# EAGLE design Tasmota_ESP32C6-2 (EAGLE 9.6.2)

## Sheet 1 of 7
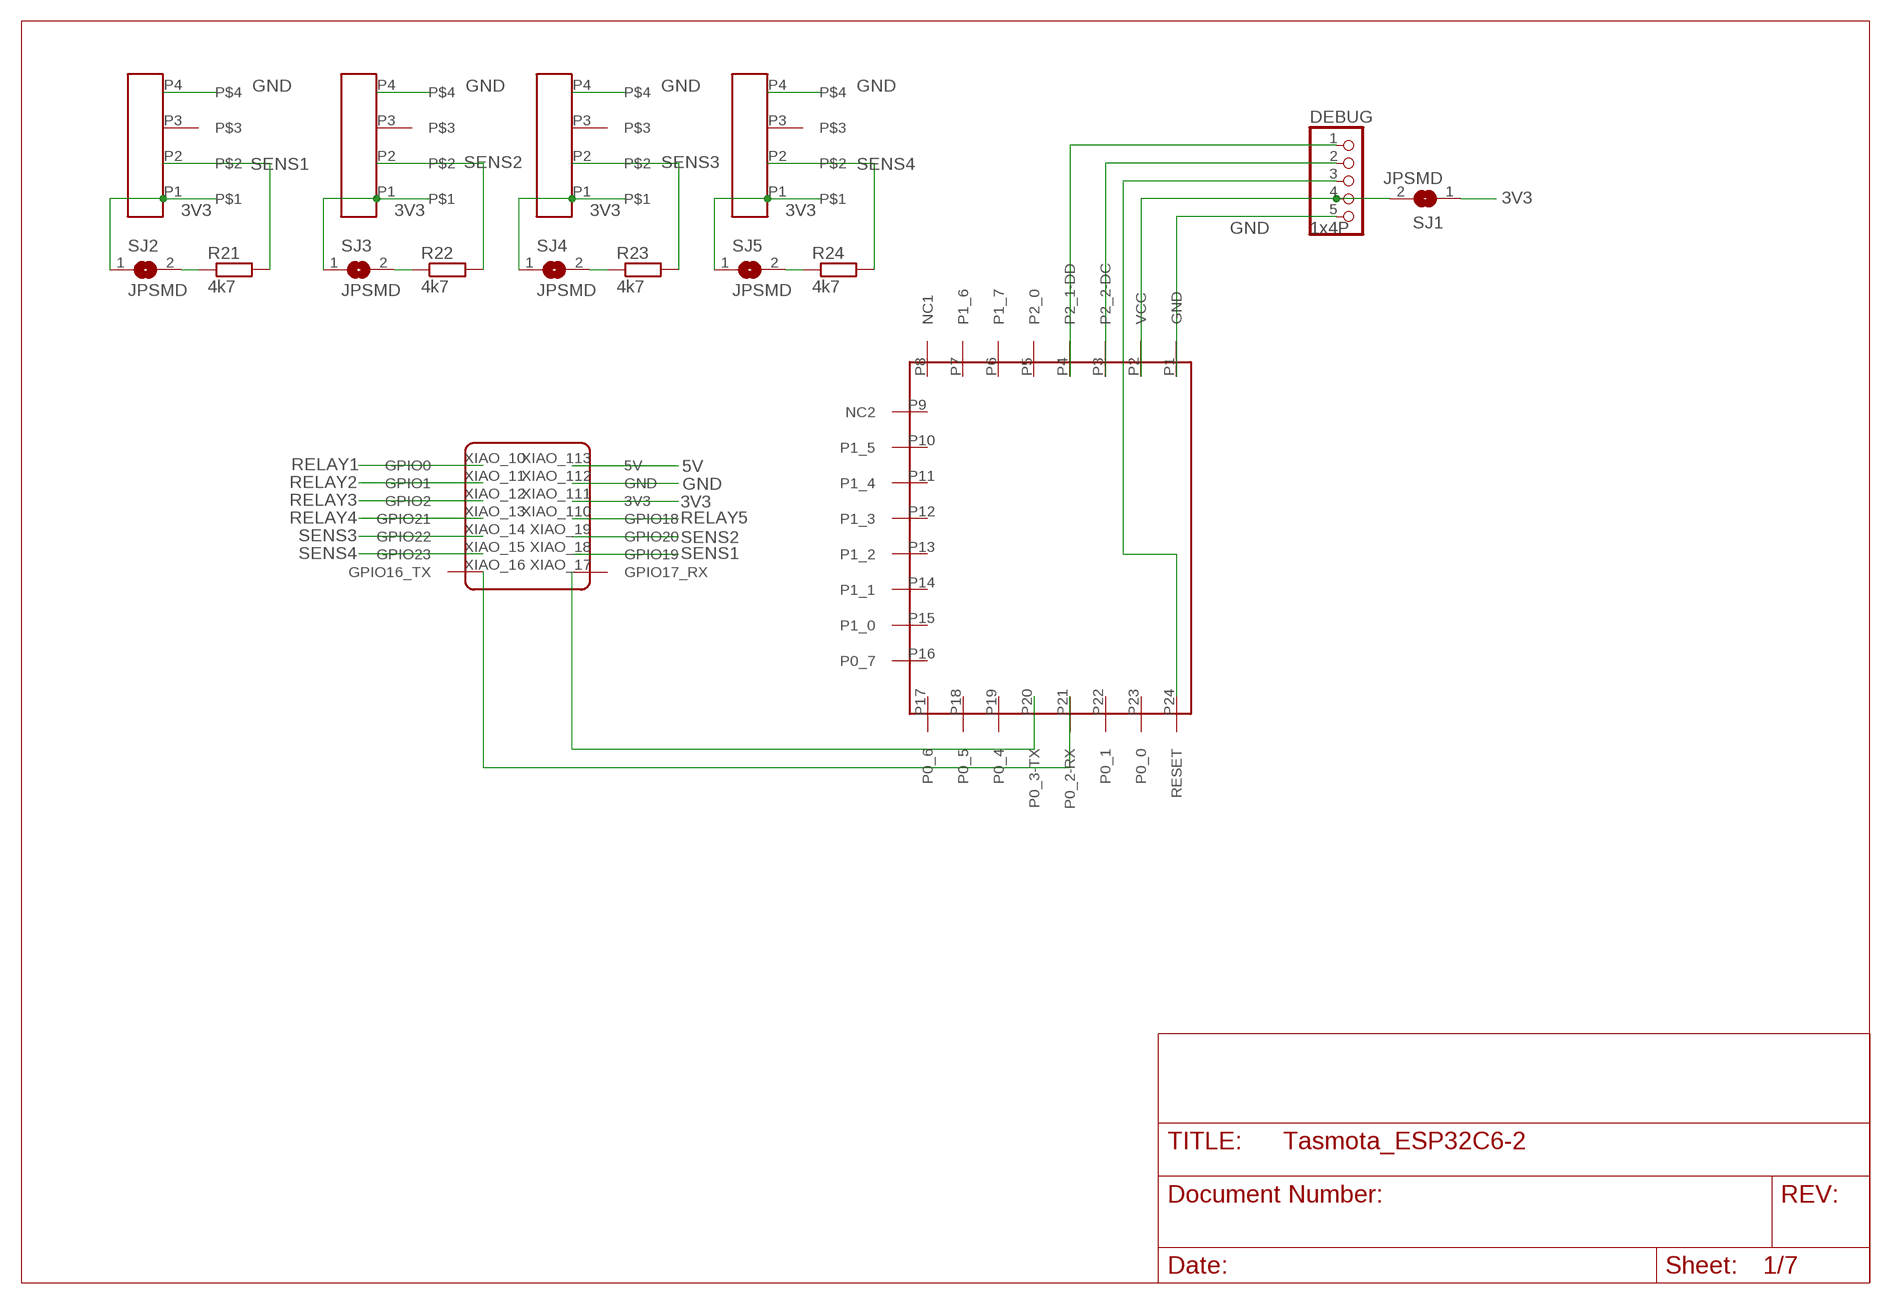
[diagram p0: schematic, sheet 1]

### Parts
DEBUG  1x4P  PINHD-1X5  [1X05]
R21  4k7  R-EU_R0805  [R0805]
R22  4k7  R-EU_R0805  [R0805]
R23  4k7  R-EU_R0805  [R0805]
R24  4k7  R-EU_R0805  [R0805]
SENSOR1  GMX-N-44  GMX-N-4  [GMX-N-4]
SENSOR2  GMX-N-44  GMX-N-4  [GMX-N-4]
SENSOR3  GMX-N-44  GMX-N-4  [GMX-N-4]
SENSOR4  GMX-N-44  GMX-N-4  [GMX-N-4]
SJ1  JPSMD  SJ  [SJ]
SJ2  JPSMD  SJ  [SJ]
SJ3  JPSMD  SJ  [SJ]
SJ4  JPSMD  SJ  [SJ]
SJ5  JPSMD  SJ  [SJ]
U$1  1x7P  XIAO_ESP32C6  [XIAO_ESP32C6]
U$2  EBYTE-E18-MS1  [EBYTE-E18-MS1]

### Nets
3V3 [pwr]: SENSOR1.P1 SENSOR2.P1 SENSOR3.P1 SENSOR4.P1 SJ1.1 SJ2.1 SJ3.1 SJ4.1 SJ5.1 U$1.XIAO_111(3V3)
5V [pwr]: U$1.XIAO_113(5V) ; also sheet 2,3,4,5,6,7
DC: DEBUG.2 U$2.P3(P2_2-DC)
DD: DEBUG.1 U$2.P4(P2_1-DD)
GND [pwr]: DEBUG.5 SENSOR1.P4 SENSOR2.P4 SENSOR3.P4 SENSOR4.P4 U$1.XIAO_112(GND) U$2.P1(GND) ; also sheet 2,3,4,5,6,7
N$4: R21.1 SJ2.2
N$5: R22.1 SJ3.2
N$7: DEBUG.3 U$2.P24(RESET)
N$8: U$1.XIAO_17(GPIO17_RX) U$2.P20(P0_3-TX)
N$9: U$1.XIAO_16(GPIO16_TX) U$2.P21(P0_2-RX)
N$10: R23.1 SJ4.2
N$15: R24.1 SJ5.2
RELAY1: U$1.XIAO_10(GPIO0) ; also sheet 3
RELAY2: U$1.XIAO_11(GPIO1) ; also sheet 4
RELAY3: U$1.XIAO_12(GPIO2) ; also sheet 5
RELAY4: U$1.XIAO_13(GPIO21) ; also sheet 6
RELAY5: U$1.XIAO_110(GPIO18) ; also sheet 7
SENS1: R21.2 SENSOR1.P2 U$1.XIAO_18(GPIO19)
SENS2: R22.2 SENSOR2.P2 U$1.XIAO_19(GPIO20)
SENS3: R23.2 SENSOR3.P2 U$1.XIAO_14(GPIO22)
SENS4: R24.2 SENSOR4.P2 U$1.XIAO_15(GPIO23)
VCC [pwr]: DEBUG.4 SJ1.2 U$2.P2(VCC)
Unconnected: SENSOR1.P3 SENSOR2.P3 SENSOR3.P3 SENSOR4.P3 U$2.P5(P2_0) U$2.P6(P1_7) U$2.P7(P1_6) U$2.P8(NC1) U$2.P9(NC2) U$2.P10(P1_5) U$2.P11(P1_4) U$2.P12(P1_3) U$2.P13(P1_2) U$2.P14(P1_1) U$2.P15(P1_0) U$2.P16(P0_7) U$2.P17(P0_6) U$2.P18(P0_5) U$2.P19(P0_4) U$2.P22(P0_1) U$2.P23(P0_0)

## Sheet 2 of 7
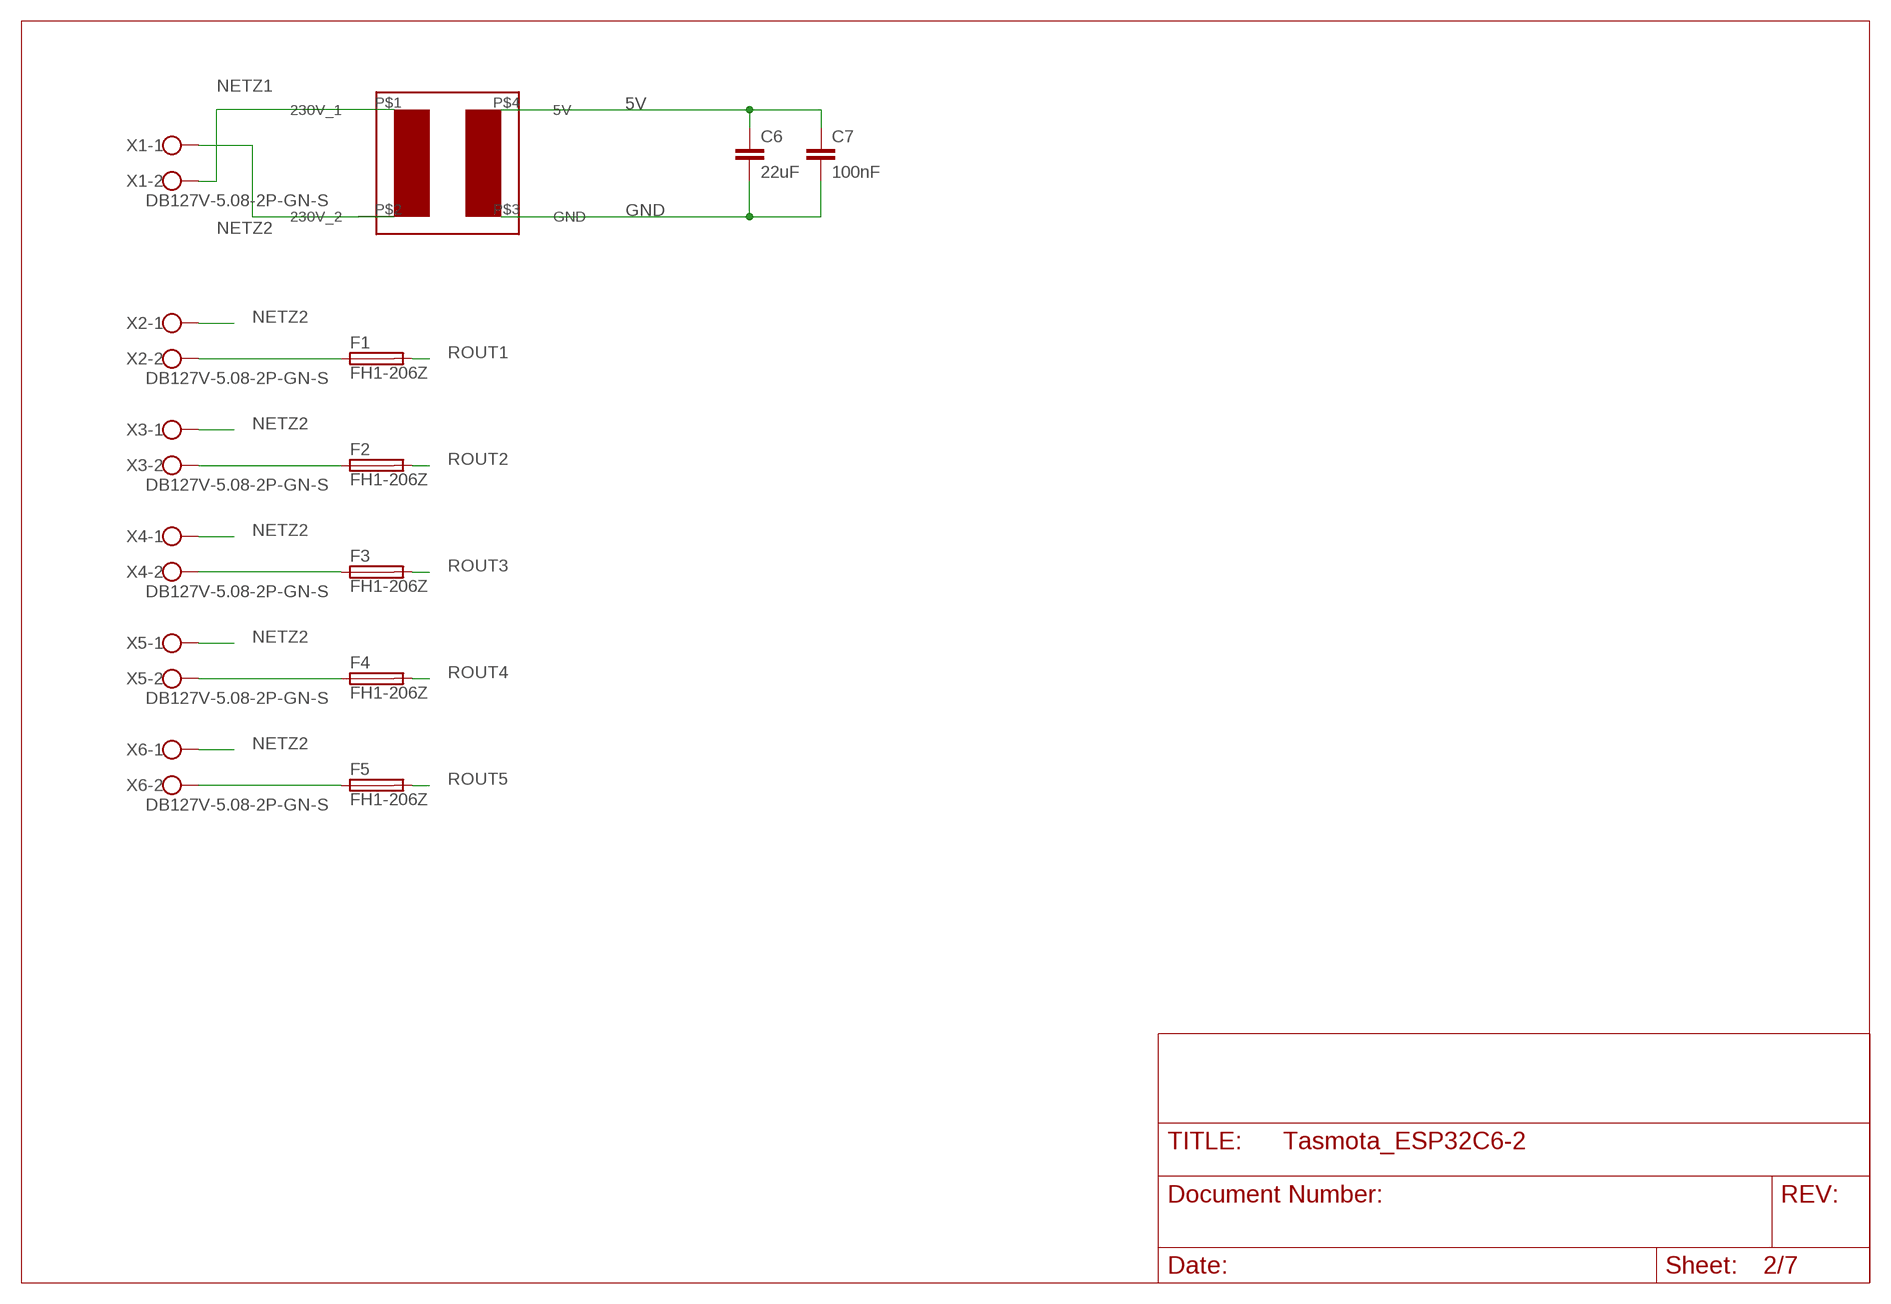
[diagram p1: schematic, sheet 2]

### Parts
C6  22uF  C-EUC0805  [C0805]
C7  100nF  C-EUC0805  [C0805]
F1  FH1-206Z  FUSEHOLDER_10  [FUSEHOLDER_10]
F2  FH1-206Z  FUSEHOLDER_10  [FUSEHOLDER_10]
F3  FH1-206Z  FUSEHOLDER_10  [FUSEHOLDER_10]
F4  FH1-206Z  FUSEHOLDER_10  [FUSEHOLDER_10]
F5  FH1-206Z  FUSEHOLDER_10  [FUSEHOLDER_10]
U$3  HAW3-220S05T2  [HAW3-220S05T2]
X1  DB127V-5.08-2P-GN-S  W237-102  [W237-102]
X2  DB127V-5.08-2P-GN-S  W237-102  [W237-102]
X3  DB127V-5.08-2P-GN-S  W237-102  [W237-102]
X4  DB127V-5.08-2P-GN-S  W237-102  [W237-102]
X5  DB127V-5.08-2P-GN-S  W237-102  [W237-102]
X6  DB127V-5.08-2P-GN-S  W237-102  [W237-102]

### Nets
5V [pwr]: C6.1 C7.1 U$3.P$4(5V) ; also sheet 1,3,4,5,6,7
GND [pwr]: C6.2 C7.2 U$3.P$3(GND) ; also sheet 1,3,4,5,6,7
N$20: F1.1 X2.2
N$25: F2.1 X3.2
N$30: F3.1 X4.2
N$31: F4.1 X5.2
N$32: F5.1 X6.2
NETZ1 [main]: U$3.P$1(230V_1) X1.2 ; also sheet 3,4,5,6,7
NETZ2 [main]: U$3.P$2(230V_2) X1.1 X2.1 X3.1 X4.1 X5.1 X6.1
ROUT1 [main]: F1.2 ; also sheet 3
ROUT2 [main]: F2.2 ; also sheet 4
ROUT3 [main]: F3.2 ; also sheet 5
ROUT4 [main]: F4.2 ; also sheet 6
ROUT5 [main]: F5.2 ; also sheet 7

## Sheet 3 of 7
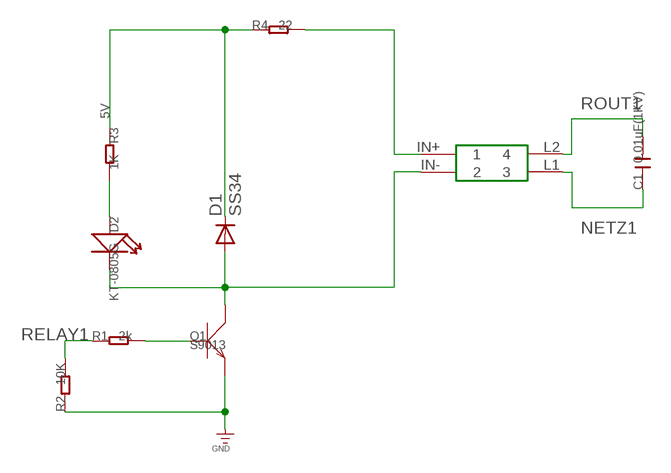
[diagram p2: schematic, sheet 3]

### Parts
C1  0.01uF(1KV)  C-1206  [C1206]
D1  SS34  DIODE-DO-214AC  [DO-214AC]
D2  KT-0805G  LED'0805'  [LED-0805]
Q1  S9013  TRANSISTOR-NPN-SOT23  [SOT23]
R1  2k  R-0805  [R0805]
R2  10K  R-0805  [R0805]
R3  1K  R-0805  [R0805]
R4  22  R-0805  [R0805]
U$4  G3MB-202P  G3MB-202(RELAY)  [G3MB-202(RELAY)]

### Nets
5V [pwr]: D1.C R3.1 R4.1 ; also sheet 1,2,4,5,6,7
GND [pwr]: Q1.2(E) R2.1 ; also sheet 1,2,4,5,6,7
N$1: Q1.1(B) R1.2
N$2: D1.A D2.- Q1.3(C) U$4.IN-
N$3: D2.+ R3.2
N$6: R4.2 U$4.IN+
NETZ1 [main]: C1.1 U$4.L1 ; also sheet 2,4,5,6,7
RELAY1: R1.1 R2.2 ; also sheet 1
ROUT1 [main]: C1.2 U$4.L2 ; also sheet 2

## Sheet 4 of 7
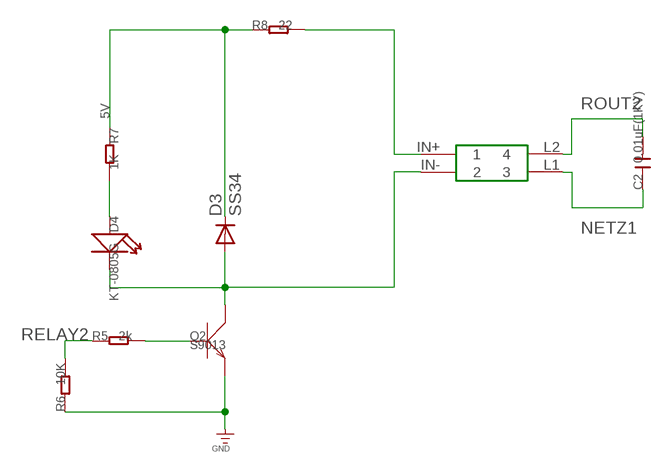
[diagram p3: schematic, sheet 4]

### Parts
C2  0.01uF(1KV)  C-1206  [C1206]
D3  SS34  DIODE-DO-214AC  [DO-214AC]
D4  KT-0805G  LED'0805'  [LED-0805]
Q2  S9013  TRANSISTOR-NPN-SOT23  [SOT23]
R5  2k  R-0805  [R0805]
R6  10K  R-0805  [R0805]
R7  1K  R-0805  [R0805]
R8  22  R-0805  [R0805]
U$6  G3MB-202P  G3MB-202(RELAY)  [G3MB-202(RELAY)]

### Nets
5V [pwr]: D3.C R7.1 R8.1 ; also sheet 1,2,3,5,6,7
GND [pwr]: Q2.2(E) R6.1 ; also sheet 1,2,3,5,6,7
N$11: Q2.1(B) R5.2
N$12: D3.A D4.- Q2.3(C) U$6.IN-
N$13: D4.+ R7.2
N$14: R8.2 U$6.IN+
NETZ1 [main]: C2.1 U$6.L1 ; also sheet 2,3,5,6,7
RELAY2: R5.1 R6.2 ; also sheet 1
ROUT2 [main]: C2.2 U$6.L2 ; also sheet 2

## Sheet 5 of 7
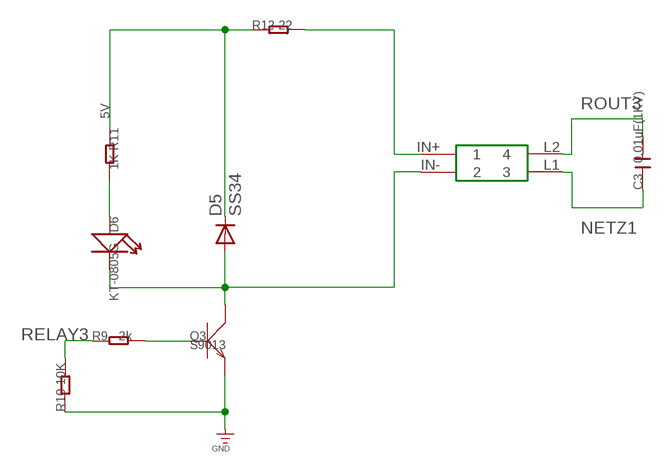
[diagram p4: schematic, sheet 5]

### Parts
C3  0.01uF(1KV)  C-1206  [C1206]
D5  SS34  DIODE-DO-214AC  [DO-214AC]
D6  KT-0805G  LED'0805'  [LED-0805]
Q3  S9013  TRANSISTOR-NPN-SOT23  [SOT23]
R9  2k  R-0805  [R0805]
R10  10K  R-0805  [R0805]
R11  1K  R-0805  [R0805]
R12  22  R-0805  [R0805]
U$8  G3MB-202P  G3MB-202(RELAY)  [G3MB-202(RELAY)]

### Nets
5V [pwr]: D5.C R11.1 R12.1 ; also sheet 1,2,3,4,6,7
GND [pwr]: Q3.2(E) R10.1 ; also sheet 1,2,3,4,6,7
N$16: Q3.1(B) R9.2
N$17: D5.A D6.- Q3.3(C) U$8.IN-
N$18: D6.+ R11.2
N$19: R12.2 U$8.IN+
NETZ1 [main]: C3.1 U$8.L1 ; also sheet 2,3,4,6,7
RELAY3: R9.1 R10.2 ; also sheet 1
ROUT3 [main]: C3.2 U$8.L2 ; also sheet 2

## Sheet 6 of 7
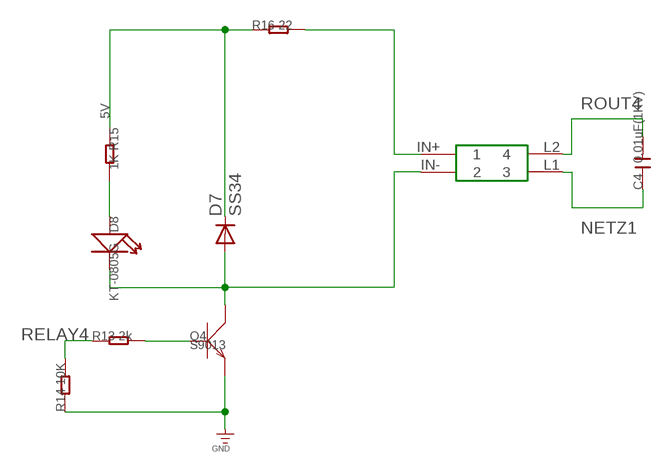
[diagram p5: schematic, sheet 6]

### Parts
C4  0.01uF(1KV)  C-1206  [C1206]
D7  SS34  DIODE-DO-214AC  [DO-214AC]
D8  KT-0805G  LED'0805'  [LED-0805]
Q4  S9013  TRANSISTOR-NPN-SOT23  [SOT23]
R13  2k  R-0805  [R0805]
R14  10K  R-0805  [R0805]
R15  1K  R-0805  [R0805]
R16  22  R-0805  [R0805]
U$10  G3MB-202P  G3MB-202(RELAY)  [G3MB-202(RELAY)]

### Nets
5V [pwr]: D7.C R15.1 R16.1 ; also sheet 1,2,3,4,5,7
GND [pwr]: Q4.2(E) R14.1 ; also sheet 1,2,3,4,5,7
N$21: Q4.1(B) R13.2
N$22: D7.A D8.- Q4.3(C) U$10.IN-
N$23: D8.+ R15.2
N$24: R16.2 U$10.IN+
NETZ1 [main]: C4.1 U$10.L1 ; also sheet 2,3,4,5,7
RELAY4: R13.1 R14.2 ; also sheet 1
ROUT4 [main]: C4.2 U$10.L2 ; also sheet 2

## Sheet 7 of 7
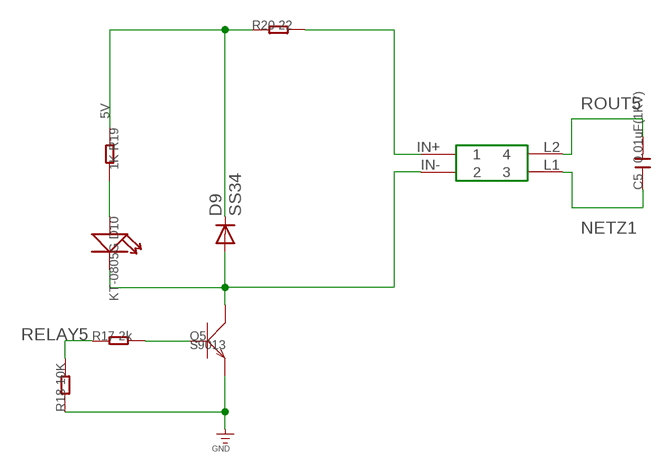
[diagram p6: schematic, sheet 7]

### Parts
C5  0.01uF(1KV)  C-1206  [C1206]
D9  SS34  DIODE-DO-214AC  [DO-214AC]
D10  KT-0805G  LED'0805'  [LED-0805]
Q5  S9013  TRANSISTOR-NPN-SOT23  [SOT23]
R17  2k  R-0805  [R0805]
R18  10K  R-0805  [R0805]
R19  1K  R-0805  [R0805]
R20  22  R-0805  [R0805]
U$12  G3MB-202P  G3MB-202(RELAY)  [G3MB-202(RELAY)]

### Nets
5V [pwr]: D9.C R19.1 R20.1 ; also sheet 1,2,3,4,5,6
GND [pwr]: Q5.2(E) R18.1 ; also sheet 1,2,3,4,5,6
N$26: Q5.1(B) R17.2
N$27: D9.A D10.- Q5.3(C) U$12.IN-
N$28: D10.+ R19.2
N$29: R20.2 U$12.IN+
NETZ1 [main]: C5.1 U$12.L1 ; also sheet 2,3,4,5,6
RELAY5: R17.1 R18.2 ; also sheet 1
ROUT5 [main]: C5.2 U$12.L2 ; also sheet 2

## Library data of the parts
C1-C5 = Discrete:C*: Ceramic Capacitors
C6 C7 = rcl:C-EU: CAPACITOR, European symbol; SPICEPREFIX: C
D1 D3 D5 D7 D9 = diode:DIODE-: DIODE
D2 D4 D6 D8 D10 = Discrete:LED*
DEBUG = pinhead:PINHD-1X5: PIN HEADER
F1-F5 = MK312parts:FUSEHOLDER_10: FUSE Wickmann; OC_FARNELL: unknown; OC_NEWARK: unknown
Q1-Q5 = Discrete:TRANSISTOR-NPN*: NPN audion
R1-R20 = Discrete:R*
R21-R24 = rcl:R-EU_: RESISTOR, European symbol; SPICEPREFIX: R
SENSOR1-SENSOR4 = MK312parts:GMX-N-4
SJ1-SJ5 = jumper:SJ: SMD solder JUMPER
U$1 = MK312parts:XIAO_ESP32C6
U$2 = MK312parts:EBYTE-E18-MS1
U$3 = MK312parts:HAW3-220S05T2
U$4 U$6 U$8 U$10 U$12 = G3MB-202(relay):G3MB-202(RELAY)
X1 = con-wago-500:W237-102: WAGO SCREW CLAMP; MPN: 237-102; OC_FARNELL: unknown; OC_NEWARK: 70K9898
X2-X6 = MK312parts:W237-102: WAGO SCREW CLAMP; MPN: 237-102; OC_FARNELL: unknown; OC_NEWARK: 70K9898

## Net classes
0 default: width 0.25 mm, drill 0.4 mm, clearance 0.2 mm
1 pwr: width 0.3 mm, drill 0.5 mm, clearance 0.2 mm
2 main: width 1 mm, drill 0.6 mm, clearance 2 mm

## Board
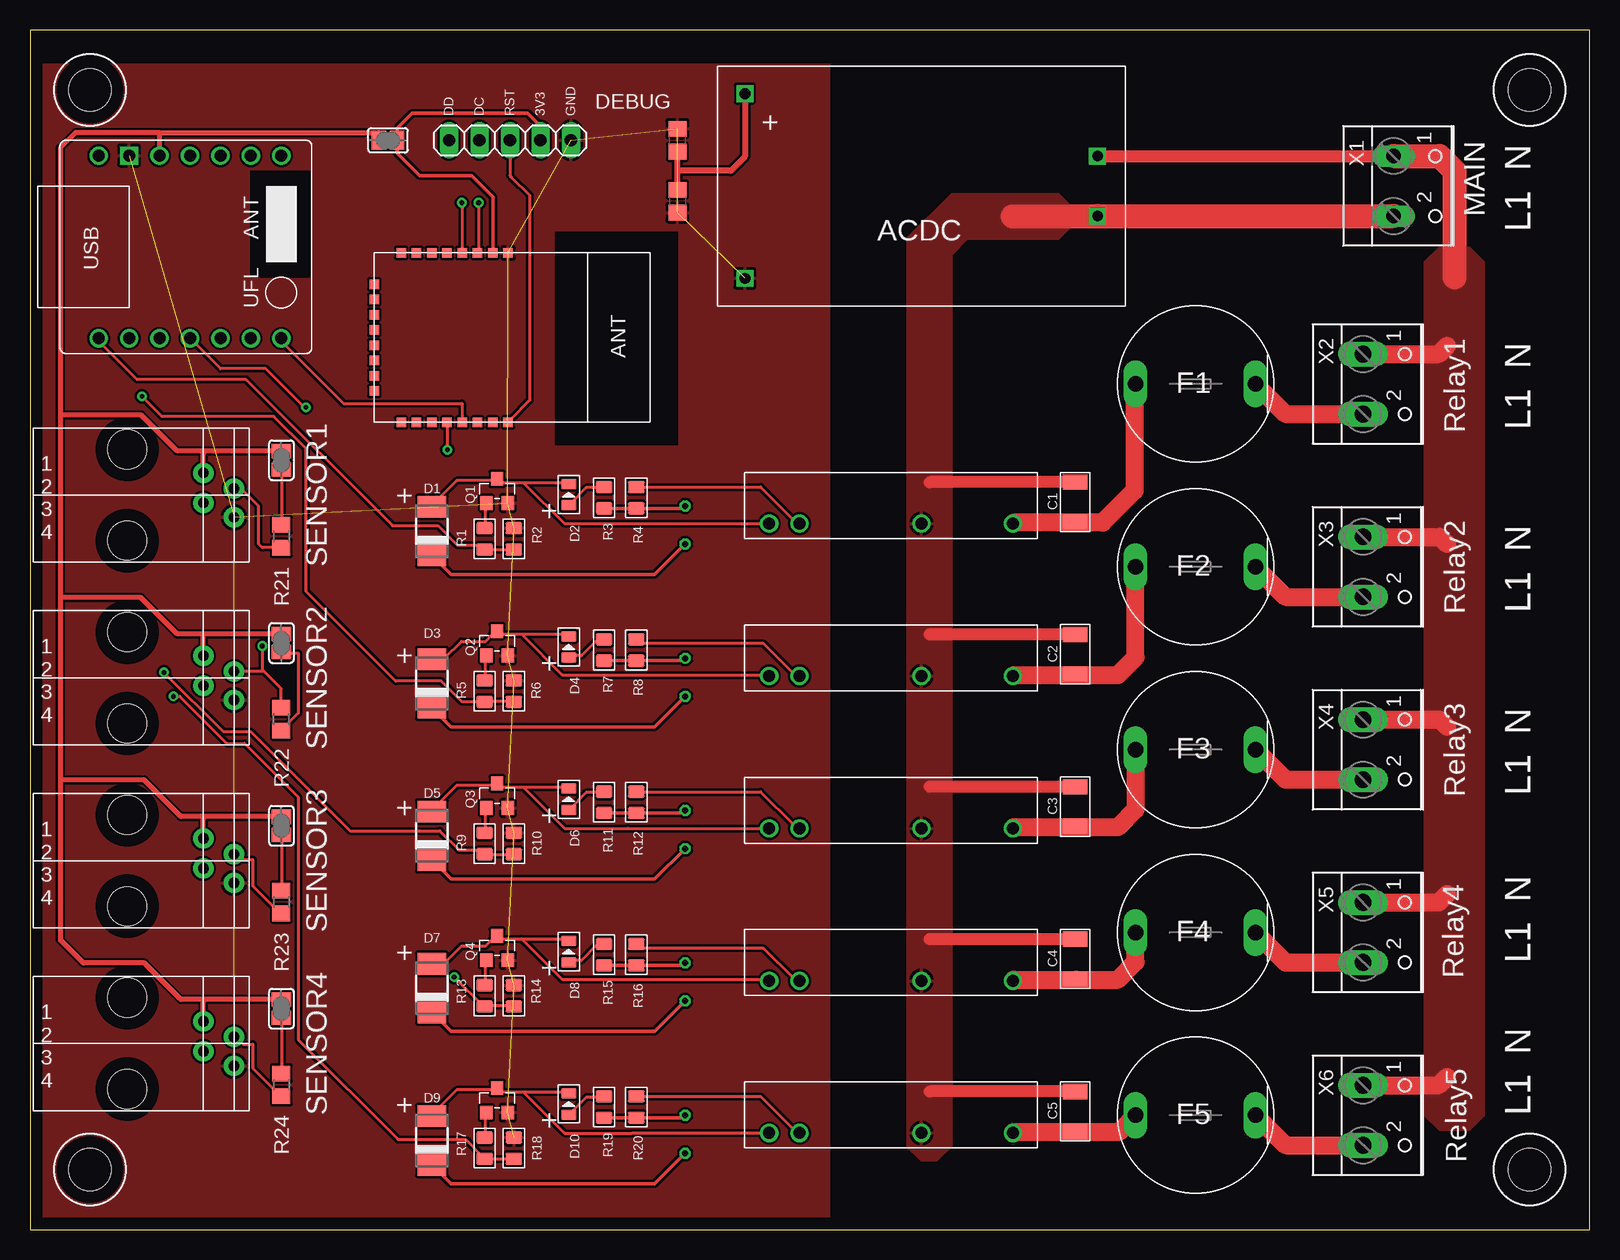
[diagram p7: board, top side]
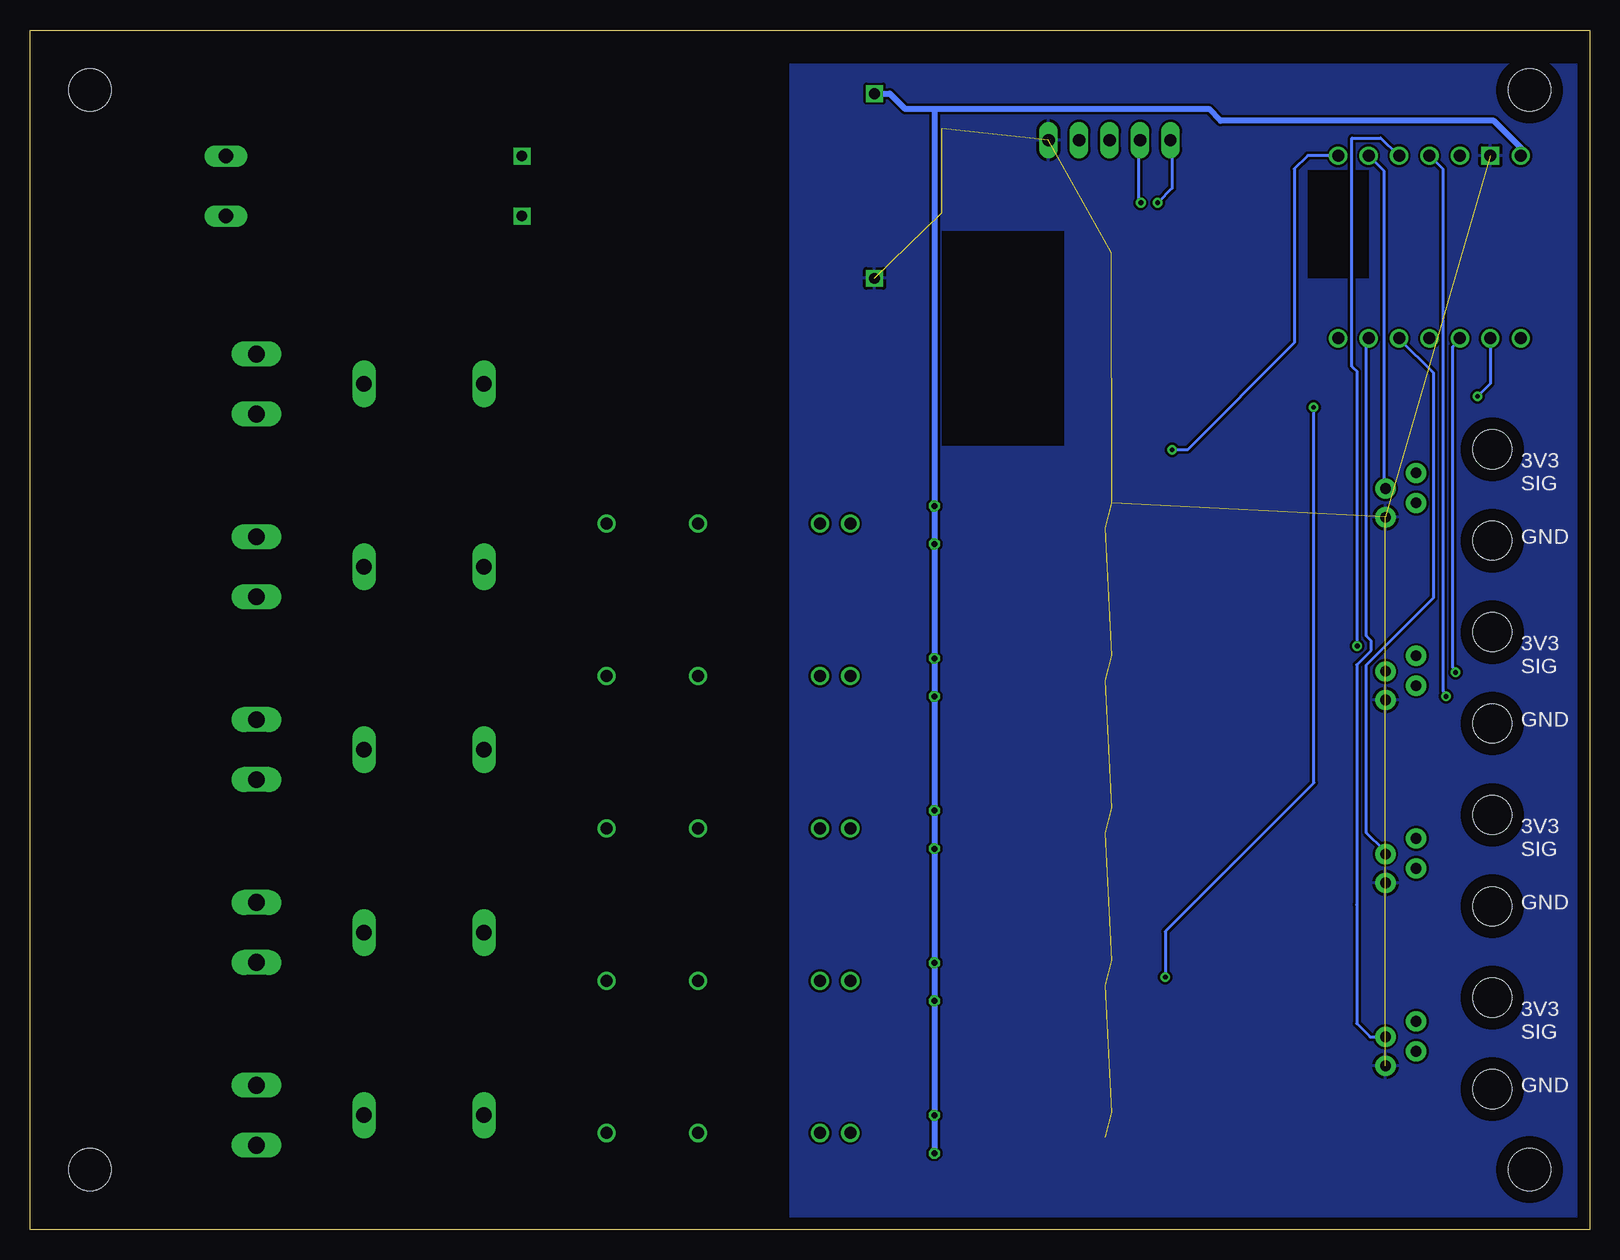
[diagram p8: board, bottom side, seen from below]

Size 130 x 100 mm. Coordinates in mm from the lower left corner, seen from the top.
Outline: 0,0 130,0 130,100 0,100 0,0
Copper layers (1*16): Top 0.035mm / dielectric 1.5mm / Bottom 0.035mm
Design rules "default": minimum track width 6mil, minimum drill 0.35mm, track to track 6mil, track to pad 6mil, pad to pad 6mil, via to via 6mil, smd to smd 6mil, copper to edge 40mil, drill to drill 6mil, minimum pad ring 10mil, minimum via ring 8mil, stop-mask expansion 4mil, vias tented up to drill 0mil, thermal gap 10mil
Holes 3.5 mm at 125,95 125,5 5,95 5,5
tRestrict: area 67.9,3.2 to 73,98.4
bRestrict: area 67.9,3.2 to 73,98.4

### Footprints (pad centres in the part's own frame; a part is rotated, then mirrored left to right if it is on the bottom)
C1206 = smd 1.27 x 2.032: 1 -1.651,0; 2 1.651,0
C0805 = smd 1.3 x 1.5: 1 -0.95,0; 2 0.95,0
DO-214AC = smd 1.8 x 2.4: A 2.025,0; C -2.025,0
LED-0805 = smd 0.889 x 1.27: + -0.889,0; - 0.889,0
1X05 = drill 1.016 long: 1 -5.08,0; 2 -2.54,0; 3 0,0; 4 2.54,0; 5 5.08,0
FUSEHOLDER_10 = drill 1.3 long: 1 -5,0; 2 5,0
SOT23 = smd 1.016 x 1.143: 1 -0.889,-1.016; 2 0.889,-1.016; 3 0,1.016
R0805 = smd 1.016 x 1.397: 1 -0.889,0; 2 0.889,0
R0805' = smd 1.3 x 1.5: 1 -0.95,0; 2 0.95,0
GMX-N-4 = drill 0.9 pad 1.676: P1 14.2,7.45; P2 16.75,6.15; P3 14.2,4.95; P4 16.75,3.75 | hole 3.25: 7.85,1.8; 7.85,9.42
SJ = smd 1.168 x 1.6: 1 -0.762,0; 2 0.762,0
XIAO_ESP32C6 = drill 1: XIAO_10 1.27,17.78; XIAO_11 1.27,15.24; XIAO_12 1.27,12.7; XIAO_13 1.27,10.16; XIAO_14 1.27,7.62; XIAO_15 1.27,5.08; XIAO_16 1.27,2.54; XIAO_17 16.51,2.54; XIAO_18 16.51,5.08; XIAO_19 16.51,7.62; XIAO_110 16.51,10.16; XIAO_111 16.51,12.7; XIAO_113 16.51,17.78 | drill 1 square: XIAO_112 16.51,15.24
EBYTE-E18-MS1 = smd 0.8 x 0.8: P1 11.14,14.11; P2 9.87,14.11; P3 8.6,14.11; P4 7.33,14.11; P5 6.06,14.11; P6 4.79,14.11; P7 3.52,14.11; P8 2.25,14.11; P9 0,11.49; P10 0,10.22; P11 0,8.95; P12 0,7.68; P13 0,6.41; P14 0,5.14; P15 0,3.87; P16 0,2.6; P17 2.25,-0.03; P18 3.52,-0.03; P19 4.79,-0.03; P20 6.06,-0.03; P21 7.33,-0.03; P22 8.6,-0.03; P23 9.87,-0.03; P24 11.14,-0.03
HAW3-220S05T2 = drill 0.9 square: P$1 -14.7,2.5; P$2 -14.7,-2.5; P$3 14.7,7.7; P$4 14.7,-7.7
G3MB-202(RELAY) = drill 1: IN+ -7.62,2.54; IN- -10.16,2.54; L1 2.54,2.54; L2 10.16,2.54
W237-102 = drill 1.194 long: 1 -2.5,-1.27; 2 2.5,-1.27
W237-102' = drill 1.4 long: 1 -2.5,-1.27; 2 2.5,-1.27

### Placement (x,y rotation side)
C1  87.12,60.66 270 top
C2  87.12,47.96 270 top
C3  87.12,35.26 270 top
C4  87.12,22.56 270 top
C5  87.12,9.86 270 top
C6  53.98,90.81 90 top
C7  53.98,85.72 270 top
D1  33.5,58.22 90 top
D2  44.91,61.26 90 top
D3  33.5,45.52 90 top
D4  44.91,48.56 90 top
D5  33.5,32.82 90 top
D6  44.91,35.86 90 top
D7  33.5,20.12 90 top
D8  44.91,23.16 90 top
D9  33.5,7.42 90 top
D10  44.91,10.46 90 top
DEBUG  40.01,90.81 0 top
F1  97.16,70.48 180 top
F2  97.16,55.24 180 top
F3  97.16,40.01 180 top
F4  97.16,24.77 180 top
F5  97.16,9.53 180 top
Q1  38.94,61.57 0 top
Q2  38.94,48.87 0 top
Q3  38.94,36.17 0 top
Q4  38.94,23.47 0 top
Q5  38.94,10.77 0 top
R1  37.9,57.58 90 top
R2  40.34,57.58 270 top
R3  47.85,61.01 90 top
R4  50.55,61.01 90 top
R5  37.9,44.88 90 top
R6  40.34,44.88 270 top
R7  47.85,48.31 90 top
R8  50.55,48.31 90 top
R9  37.9,32.18 90 top
R10  40.34,32.18 270 top
R11  47.85,35.61 90 top
R12  50.55,35.61 90 top
R13  37.9,19.48 90 top
R14  40.34,19.48 270 top
R15  47.85,22.91 90 top
R16  50.55,22.91 90 top
R17  37.9,6.78 90 top
R18  40.34,6.78 270 top
R19  47.85,10.21 90 top
R20  50.55,10.21 90 top
R21  4k7  [R0805']  20.95,57.78 270 top
R22  4k7  [R0805']  20.95,42.55 90 top
R23  4k7  [R0805']  20.95,27.3 270 top
R24  4k7  [R0805']  20.95,12.06 270 top
SENSOR1  0.25,55.63 0 top
SENSOR2  0.25,40.39 0 top
SENSOR3  0.25,25.15 0 top
SENSOR4  0.25,9.91 0 top
SJ1  29.84,90.81 0 top
SJ2  20.95,64.14 270 top
SJ3  20.95,48.9 270 top
SJ4  20.95,33.66 270 top
SJ5  20.95,18.41 270 top
U$1  23.5,73.03 90 top
U$2  28.7,67.31 0 top
U$3  74.3,87 180 top
U$4  71.78,56.3 0 top
U$6  71.78,43.6 0 top
U$8  71.78,30.9 0 top
U$10  71.78,18.2 0 top
U$12  71.78,5.5 0 top
X1  114.94,87 270 top
X2  DB127V-5.08-2P-GN-S  [W237-102']  112.39,70.48 270 top
X3  DB127V-5.08-2P-GN-S  [W237-102']  112.39,55.24 270 top
X4  DB127V-5.08-2P-GN-S  [W237-102']  112.39,40.01 270 top
X5  DB127V-5.08-2P-GN-S  [W237-102']  112.39,24.77 270 top
X6  DB127V-5.08-2P-GN-S  [W237-102']  112.39,9.53 270 top

### Tracks (layer width: path | path; a pad name or v marks a point on that pad's centre or on a via)
3V3
  Top 0.406: U$1.XIAO_111 10.79,91.44 | 10.79,91.44 29.08,91.44 SJ1.1 | 10.79,91.44 3.81,91.44 2.54,90.17 2.54,67.94 | 2.54,67.94 2.54,52.7 | 2.54,52.7 2.54,37.47 | 2.54,37.47 2.54,24.13 4.45,22.23 9.53,22.23 12.57,19.18 14.61,19.18 | SJ2.1 14.61,64.9 | 14.61,64.9 12.28,64.9 9.28,67.89 2.6,67.89 2.54,67.94 | 2.54,37.47 9.53,37.47 12.57,34.42 14.61,34.42 | SENSOR1.P1 14.45,64.75 14.61,64.9 | SJ3.1 14.61,49.66 | 14.61,49.66 12.28,49.66 9.23,52.7 2.54,52.7 | SENSOR2.P1 14.45,49.51 14.61,49.66 | SJ4.1 14.61,34.42 | SENSOR3.P1 14.45,34.27 14.61,34.42 | SJ5.1 14.61,19.18 | SENSOR4.P1 14.45,19.03 14.61,19.18
5V  (via drill 0.5)
  Top 0.3: R3.1 R4.1 54.41,60.12 v54.61,60.33 | R7.1 R8.1 54.41,47.42 v54.61,47.62 | R11.1 R12.1 54.41,34.72 v54.61,34.92 | R15.1 R16.1 54.41,22.02 v54.61,22.23 | R19.1 R20.1 54.41,9.32 v54.61,9.53 | D7.C 35.08,16.51 52.07,16.51 v54.61,19.05 | D9.C 35.08,3.81 52.07,3.81 v54.61,6.35 | D5.C 35.08,29.21 52.07,29.21 v54.61,31.75 | D3.C 35.08,41.91 52.07,41.91 v54.61,44.45 | D1.C 35.08,54.61 52.07,54.61 v54.61,57.15
  Top 0.508: C7.1 53.98,88.27 | 53.98,88.27 C6.1 | U$3.P$4 59.59,89.44 58.42,88.27 53.98,88.27
  Bottom 0.508: U$3.P$4 58.33,94.69 57.05,93.42 54.61,93.42 | 54.61,93.42 31.75,93.42 30.76,92.43 7.98,92.43 5.71,90.17 U$1.XIAO_113 | 54.61,93.42 v54.61,60.33 v54.61,57.15 v54.61,47.62 v54.61,44.45 v54.61,34.92 v54.61,31.75 v54.61,22.23 v54.61,19.05 v54.61,9.53 v54.61,6.35
DC  (via drill 0.4)
  Top 0.25: v37.4,85.6 37.4,81.47 U$2.P3
  Bottom 0.25: v37.4,85.6 37.6,85.8 37.6,90.67 DEBUG.2
DD  (via drill 0.4)
  Top 0.254: v36,85.6 36,81.45 U$2.P4
  Bottom 0.25: v36,85.6 34.8,86.8 34.8,90.67 DEBUG.1
GND  (19 unrouted)
  pour Top: 66.67,97.16 0.64,97.16 0.64,0.64 66.67,0.64
  pour Bottom: 0.64,97.16 66.67,97.16 66.67,0.64 65.41,0.64 0.64,0.64
  cutout Bottom: 43.81,83.19 53.98,83.19 53.98,65.41 43.81,65.41
  cutout Bottom: 18.41,88.27 23.5,88.27 23.5,79.38 18.41,79.38
  cutout Top: 18.41,88.27 23.5,88.27 23.5,79.38 18.41,79.38
  cutout Top: 43.81,83.19 53.98,83.19 53.98,65.41 43.81,65.41
N$1
  Top 0.25: Q1.1 37.97,60.44 37.97,58.63 R1.2
N$2
  Top 0.25: 41.16,62.23 44.77,62.23 D2.- | 41.16,62.23 39.16,62.23 38.97,62.44 Q1.3 38.77,62.44 35.56,62.44 33.56,60.44 D1.A | 41.16,62.23 44.56,58.84 49.82,58.84 U$4.IN-
N$3
  Top 0.25: D2.+ 44.97,60.44 46.37,61.84 47.77,61.84 R3.2
N$4
  Top 0.25: R21.1 20.96,58.84 20.96,63.24 SJ2.2
N$5
  Top 0.25: R22.1 20.96,41.65 22.36,43.05 22.36,48.05 20.96,48.05 SJ3.2
N$6
  Top 0.25: R4.2 60.9,61.9 63.77,59.03 63.97,59.03 U$4.IN+
N$7
  Top 0.25: 40.12,87.75 41.66,86.21 41.66,69.13 40,67.47 U$2.P24
  Top 0.254: DEBUG.3 40.01,87.86 40.12,87.75
N$8  (via drill 0.4)
  Top 0.25: v34.8,65 34.8,67.27 U$2.P20
  Bottom 0.25: v34.8,65 33.53,65 24.61,73.92 24.61,88.42 23.5,89.53 U$1.XIAO_17
N$9
  Top 0.25: U$2.P21 36,67.47 36,68.87 26.13,68.87 20.8,74.2 U$1.XIAO_16
N$10
  Top 0.25: R23.1 20.96,28.45 20.96,32.84 SJ4.2
N$11
  Top 0.25: Q2.1 37.97,47.84 37.97,45.84 R5.2
N$12
  Top 0.25: 38.56,49.63 37.97,49.03 35.97,49.03 34.56,47.63 33.56,47.63 D3.A | 38.56,49.63 38.77,49.84 Q2.3 38.56,49.63 | 38.56,49.63 40.97,49.63 | 40.97,49.63 44.77,49.63 D4.- | 40.97,49.63 44.37,46.23 61.56,46.23 U$6.IN-
N$13
  Top 0.25: D4.+ 44.97,47.84 45.97,47.84 47.16,49.03 47.77,49.03 R7.2
N$14
  Top 0.25: R8.2 50.56,49.03 50.77,48.84 61.16,48.84 63.77,46.23 63.97,46.23 U$6.IN+
N$15
  Top 0.25: R24.1 20.96,13.04 20.96,17.64 SJ5.2
N$16
  Top 0.25: Q3.1 37.97,35.03 37.97,33.23 R9.2
N$17
  Top 0.25: 41.16,36.84 44.77,36.84 D6.- | 41.16,36.84 39.16,36.84 38.97,37.03 Q3.3 38.77,37.03 35.56,37.03 33.56,35.03 D5.A | 41.16,36.84 44.56,33.44 49.82,33.44 U$8.IN-
N$18
  Top 0.25: D6.+ 44.97,35.03 46.37,36.44 47.77,36.44 R11.2
N$19
  Top 0.25: R12.2 60.9,36.5 63.77,33.63 63.97,33.63 U$8.IN+
N$20
  Top 1.5: F1.1 104.66,67.98 X2.2
N$21
  Top 0.25: Q4.1 37.97,22.43 37.97,20.43 R13.2
N$22
  Top 0.25: 38.56,24.23 37.97,23.64 35.97,23.64 34.56,22.23 33.56,22.23 D7.A | 38.56,24.23 38.77,24.43 Q4.3 38.56,24.23 | 38.56,24.23 40.97,24.23 | 40.97,24.23 44.77,24.23 D8.- | 40.97,24.23 44.37,20.84 61.56,20.84 U$10.IN-
N$23
  Top 0.25: D8.+ 44.97,22.43 45.97,22.43 47.16,23.64 47.77,23.64 R15.2
N$24
  Top 0.25: R16.2 50.56,23.64 50.77,23.43 61.16,23.43 63.77,20.84 63.97,20.84 U$10.IN+
N$25
  Top 1.5: F2.1 104.66,52.74 X3.2
N$26
  Top 0.25: Q5.1 37.97,9.63 37.97,7.83 R17.2
N$27
  Top 0.25: 41.16,11.44 44.77,11.44 D10.- | 41.16,11.44 39.16,11.44 38.97,11.63 Q5.3 38.77,11.63 35.56,11.63 33.56,9.63 D9.A | 41.16,11.44 44.56,8.04 50.19,8.04 U$12.IN-
N$28
  Top 0.25: D10.+ 44.97,9.63 46.37,11.04 47.77,11.04 R19.2
N$29
  Top 0.25: R20.2 60.9,11.1 63.77,8.23 63.97,8.23 U$12.IN+
N$30
  Top 1.5: F3.1 104.66,37.51 X4.2
N$31
  Top 1.5: F4.1 104.66,22.27 X5.2
N$32
  Top 1.5: F5.1 104.66,7.03 X6.2
NETZ1
  Top 1.016: C1.1 75.01,62.31 | C2.1 75.01,49.61 | C3.1 75.01,36.91 | C4.1 75.01,24.21 | C5.1 75.01,11.51
  Top 2: X1.2 U$3.P$1 88.95,84.45 81.92,84.45
  pour Top: 73.03,6.99 74.3,5.71 75.56,5.71 76.83,6.99 76.83,81.28 78.11,82.55 85.72,82.55 87,83.82 87,85.09 85.72,86.36 76.83,86.36 73.03,82.55
NETZ2
  Top 1.016: U$3.P$2 X1.1
  Top 1.5: X2.1 117.44,72.98 118.11,73.66 | X3.1 117.52,57.74 118.11,57.15 | X4.1 117.52,42.51 118.11,41.91 | X5.1 117.44,27.27 118.11,27.94 | X6.1 117.44,12.03 118.11,12.7
  Top 2: X1.1 117.52,89.5 118.75,88.27 118.75,79.38
  pour Top: 116.2,9.53 117.47,8.26 120.02,8.26 121.28,9.53 121.28,80.64 120.02,81.92 117.47,81.92 116.2,80.64
RELAY1
  Top 0.25: R2.2 40.16,56.63 37.97,56.63 R1.1 37.6,57.07 35.6,57.07 34,58.67 30.21,58.67 17.98,70.89 8.9,70.89 5.6,74.2 U$1.XIAO_10
RELAY2  (via drill 0.4)
  Top 0.25: R5.1 37.97,44.03 40.16,44.03 R6.2 | v9.33,69.46 11.01,67.78 20.32,67.78 23,65.11 23,59.69
  Top 0.254: R5.1 36.02,43.99 34.29,45.72 30.48,45.72 23,53.2 23,59.69
  Bottom 0.25: v9.33,69.46 8.26,70.53 U$1.XIAO_11
RELAY3  (via drill 0.4)
  Top 0.25: R10.2 40.16,31.23 37.97,31.23 R9.1 37.77,31.43 37.56,31.64 35.77,31.64 34.16,33.23 26.67,33.23 | v11.16,46.45 16.11,41.51
  Top 0.254: 16.11,41.51 18.4,41.51 26.67,33.23
  Bottom 0.25: U$1.XIAO_12 10.8,74.2 11.4,73.6 11.4,46.88 11.2,46.68 11.2,46.48 v11.16,46.45
RELAY4  (via drill 0.4)
  Top 0.25: R14.2 40.16,18.64 37.97,18.64 R13.1 37.77,18.64 v35.37,21.04 | v23,68.55 22.86,68.55 19.66,71.75 15.88,71.75 U$1.XIAO_13
  Bottom 0.25: v35.37,21.04 35.37,24.84 22.96,37.24 23,37.28 v23,68.55
RELAY5  (via drill 0.4)
  Top 0.25: R18.2 40.16,5.83 37.97,5.83 R17.1 37.77,6.04 36.3,7.5 30.68,7.5 22.36,15.82 22.36,34.29 | 16.41,40.53 12.49,44.45 v11.96,44.45
  Top 0.254: 16.41,40.53 17.89,40.53 22.36,36.05 22.36,34.29
  Bottom 0.25: U$1.XIAO_110 12.2,88.4 12.2,44.88 12,44.68 12,44.48 v11.96,44.45
ROUT1
  Top 1: C1.2 87.2,59.07 87.2,58.92
  Top 1.5: U$4.L2 82.02,58.92 87.2,58.92 89.4,58.92 92.08,61.59 92.08,70.41 F1.2
ROUT2
  Top 1: C2.2 87.2,46.27 87.2,46.22
  Top 1.5: U$6.L2 82.02,46.22 87.2,46.22 90.67,46.22 92.16,47.7 F2.2
ROUT3
  Top 1: C3.2 87.2,33.67 87.2,33.52
  Top 1.5: U$8.L2 82.02,33.52 87.2,33.52 90.67,33.52 92.16,35.01 F3.2
ROUT4
  Top 1: C4.2 87.2,20.87 87.2,20.82
  Top 1.5: U$10.L2 82.02,20.82 87.2,20.82 90.67,20.82 92.16,22.3 F4.2
ROUT5
  Top 1: C5.2 87.2,8.27 87.2,8.12
  Top 1.5: U$12.L2 82.02,8.12 87.2,8.12 90.75,8.12 F5.2
SENS1
  Top 0.254: R21.2 19.36,56.84 19.05,57.15 19.05,60.33 17.6,61.78 SENSOR1.P2
  Bottom 0.254: U$1.XIAO_18 17.14,88.27 17.14,61.92 SENSOR1.P2
SENS2  (via drill 0.4)
  Top 0.254: R22.2 20.95,45.09 19.5,46.54 | 19.5,46.54 SENSOR2.P2 | v19.36,48.65 19.36,46.67 19.5,46.54
  Bottom 0.25: v19.36,48.65 19.36,71.5 19.8,71.94 19.8,91 17.4,91 16,89.6 U$1.XIAO_19
SENS3
  Top 0.25: R23.2 20.77,26.45 18.57,28.64 18.57,30.84 17.77,30.84 17.36,31.25 17.16,31.25 SENSOR3.P2
  Bottom 0.25: SENSOR3.P2 17.16,31.45 17.16,31.64 18.6,33.08 18.6,47.08 13,52.68 13,71.4 15.8,74.2 U$1.XIAO_14
SENS4
  Top 0.25: R24.2 20.77,11.24 18.57,13.45 18.57,15.45 17.77,15.45 17.16,16.05 SENSOR4.P2
  Bottom 0.25: 19.4,27.08 19.4,47.08 18.2,48.28 18.2,49.08 18.6,49.48 18.6,74.2 U$1.XIAO_15
  Bottom 0.254: 19.4,27.08 19.4,17.18 18.27,16.06 SENSOR4.P2
VCC
  Top 0.3: U$2.P2 38.6,81.47 38.6,86.06 36.83,87.83 32.49,87.83 30.61,89.72 SJ1.2 30.61,91.82 31.86,93.07 41.47,93.07 42.55,92 DEBUG.4

### Text on the board
tPlace: + | + | + | + | + | + | + | + | + | + | +
bPlace: 3V3 | SIG | GND | 3V3 | SIG | GND | 3V3 | SIG | GND | 3V3 | SIG | GND
tNames: DD | DC | RST | 3V3 | GND | N | MAIN | L1 | ACDC | N | L1 | Relay1 | N | SENSOR1 | Relay2 | L1 | N | SENSOR2 | Relay3 | L1 | N | SENSOR3 | L1 | Relay4 | N | SENSOR4 | L1 | Relay5